# EAGLE design ADC (EAGLE 6.5.0)
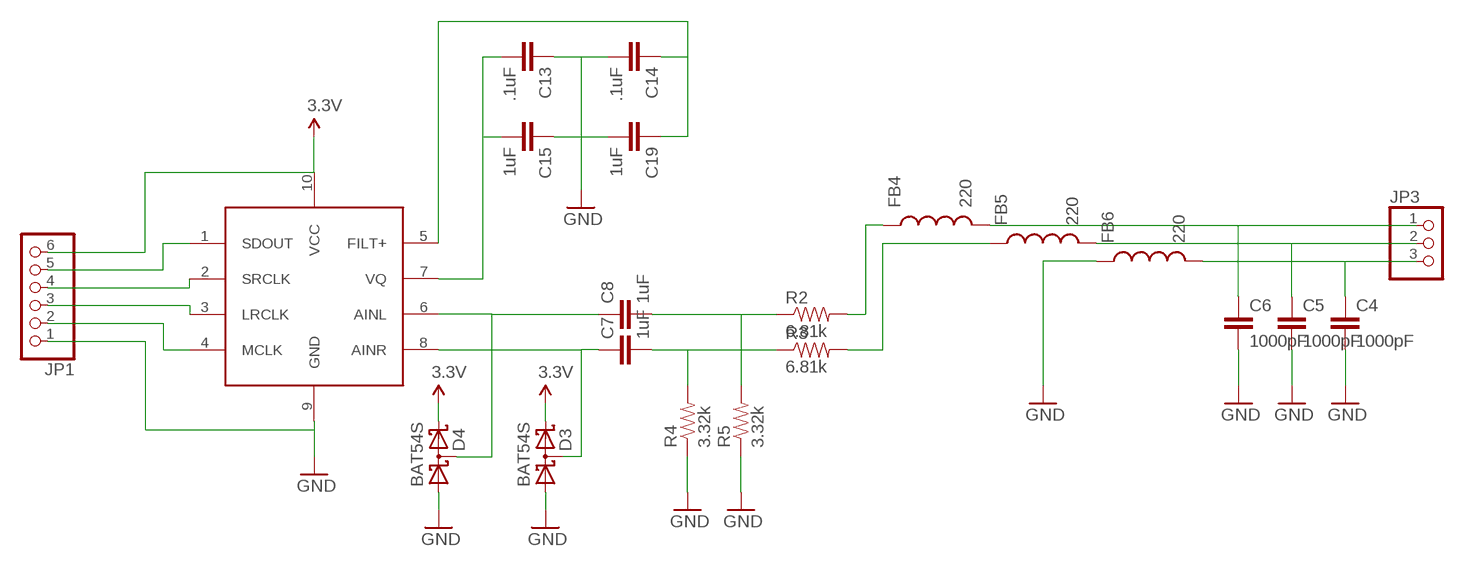
[diagram p0: schematic, sheet 1]

## Parts
C4  1000pF  CAP0402-CAP  [0402-CAP]
C5  1000pF  CAP0402-CAP  [0402-CAP]
C6  1000pF  CAP0402-CAP  [0402-CAP]
C7  1uF  CAP0402-CAP  [0402-CAP]
C8  1uF  CAP0402-CAP  [0402-CAP]
C13  .1uF  CAP0402-CAP  [0402-CAP]
C14  .1uF  CAP0402-CAP  [0402-CAP]
C15  1uF  CAP0402-CAP  [0402-CAP]
C19  1uF  CAP0402-CAP  [0402-CAP]
D3  BAT54S  [SOT23]
D4  BAT54S  [SOT23]
FB4  220  INDUCTOR0805  [0805]
FB5  220  INDUCTOR0805  [0805]
FB6  220  INDUCTOR0805  [0805]
JP1  PINHD-1X6  [1X06]
JP3  PINHD-1X3  [1X03]
R2  6.81k  RESISTOR0603-RES  [0603-RES]
R3  6.81k  RESISTOR0603-RES  [0603-RES]
R4  3.32k  RESISTOR0603-RES  [0603-RES]
R5  3.32k  RESISTOR0603-RES  [0603-RES]
U$3  CS5343  [TSSOP-10]

## Nets
AIN_SLEEV: C4.1 FB6.2 JP3.3
AINL: C6.1 FB4.2 JP3.1
AINL_C: C8.1 D4.3(C1A2) U$3.6(AINL)
AINL_FB: FB4.1 R2.2
AINL_R: C8.2 R2.1 R5.2
AINR: C5.1 FB5.2 JP3.2
AINR_C: C7.1 D3.3(C1A2) U$3.8(AINR)
AINR_FB: FB5.1 R3.2
AINR_R: C7.2 R3.1 R4.2
GND: C4.2 C5.2 C6.2 C13.1 C14.2 C15.1 C19.2 D3.1(A1) D4.1(A1) FB6.1 JP1.1 R4.1 R5.1 U$3.9(GND)
LRCLK: JP1.3 U$3.3(LRCLK)
MCLK: JP1.2 U$3.4(MCLK)
N$1: C13.2 C15.2 U$3.7(VQ)
N$6: C14.1 C19.1 U$3.5(FILT+)
SCLK: JP1.4 U$3.2(SRCLK)
SOUT: JP1.5 U$3.1(SDOUT)
VCC: D3.2(C2) D4.2(C2) JP1.6 U$3.10(VCC) ; supply symbol labelled 3.3V

## Library data of the parts
C4-C8 C13-C15 C19 = 1x05smd:CAP: Capacitor Standard 0603 ceramic capacitor, and 0.1" leaded capacitor.
D3 D4 = diode:BAT54S: Schottky Diodes Pin connection corrected 2011-05-04 Source: Fairchild .. BAT54.pdf
FB4-FB6 = SparkFun-Passives:INDUCTOR: Inductors Basic Inductor/Choke - 0603 and 1206. Footprints are not proven and vary greatly between part numbers.
JP1 = adafruit:PINHD-1X6: PIN HEADER
JP3 = adafruit:PINHD-1X3: PIN HEADER
R2-R5 = 1x05smd:RESISTOR: Resistor Basic schematic elements and footprints for 0603, 1206, and PTH 1/10th watt (small) resistors.
U$3 = Strutz Electronic Industries:CS5343

## Board
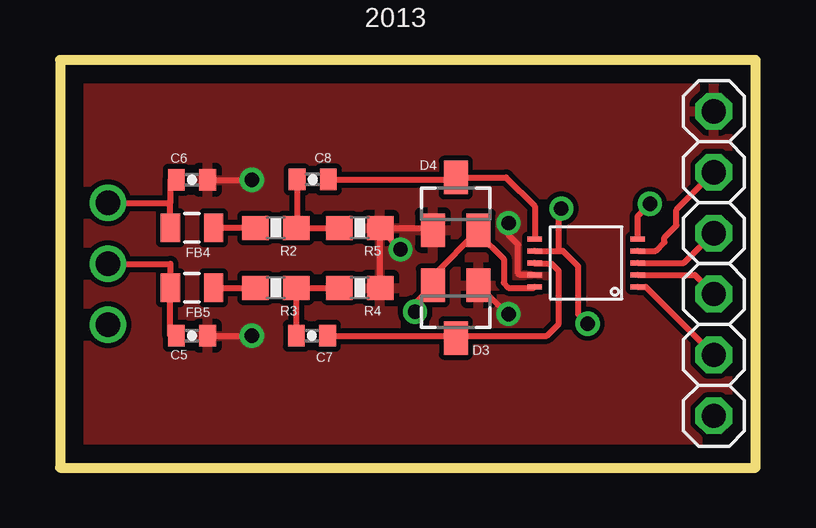
[diagram p1: board, top side]
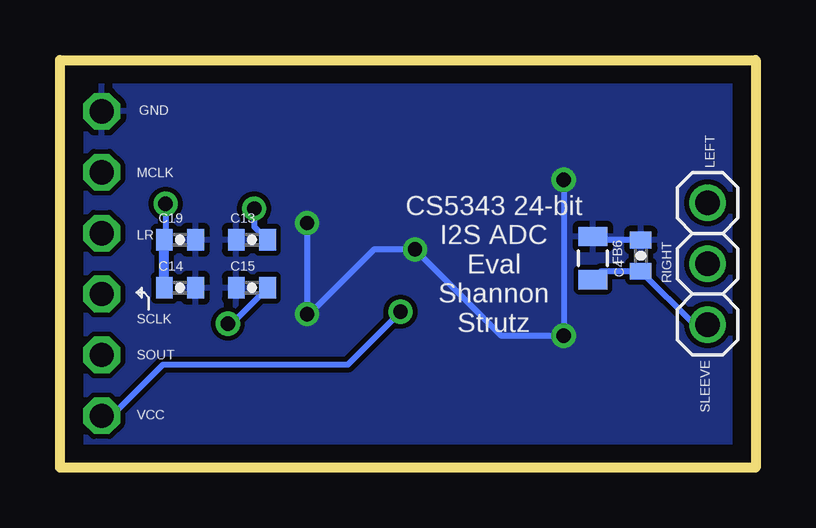
[diagram p2: board, bottom side, seen from below]

Size 29 x 17 mm. Coordinates in mm from the lower left corner, seen from the top.
Outline: 29,0 29,17 0,17 0,0 29,0
Copper layers (1*16): Top 0.035mm / dielectric 0.2mm / Bottom 0.035mm
Design rules "default *": minimum track width 10mil, minimum drill 24mil, track to track 8mil, track to pad 8mil, pad to pad 8mil, via to via 8mil, smd to smd 8mil, copper to edge 30mil, drill to drill 8mil, minimum pad ring 10mil, minimum via ring 8mil, stop-mask expansion 4mil, vias tented up to drill 0mil, thermal gap 10mil

### Footprints (pad centres in the part's own frame; a part is rotated, then mirrored left to right if it is on the bottom)
0402-CAP = smd 0.7 x 0.9: 1 -0.65,0; 2 0.65,0
SOT23 = smd 1 x 1.4: 1 -0.95,-1.1; 2 0.95,-1.1; 3 0,1.1
0805 = smd 0.8 x 1.2: 1 -0.9,0; 2 0.9,0
1X06 = drill 1.016 octagon: 1 -6.35,0; 2 -3.81,0; 3 -1.27,0; 4 1.27,0; 5 3.81,0; 6 6.35,0
1X03 = drill 1.016: 1 -2.54,0; 2 0,0; 3 2.54,0
0603-RES = smd 1.1 x 1: 1 -0.85,0; 2 0.85,0
TSSOP-10 = smd 0.6 x 0.2: 1 -2.15,1; 2 -2.15,0.5; 3 -2.15,0; 4 -2.15,-0.5; 5 -2.15,-1; 6 2.15,-1; 7 2.15,-0.5; 8 2.15,0; 9 2.15,0.5; 10 2.15,1

### Placement (x,y rotation side)
C4  4.78,8.84 90 bottom
C5  5.5,5.5 0 top
C6  5.5,12 0 top
C7  10.5,5.5 180 top
C8  10.54,12.02 180 top
C13  21,9.5 0 bottom
C14  24,7.5 0 bottom
C15  21,7.5 0 bottom
C19  24,9.5 0 bottom
D3  16.5,6.5 180 top
D4  16.5,11 0 top
FB4  5.5,10 180 top
FB5  5.5,7.5 180 top
FB6  6.78,8.74 270 bottom
JP1  27.26,8.51 270 top
JP3  2,8.5 270 bottom
R2  9,10 180 top
R3  9,7.5 180 top
R4  12.5,7.5 180 top
R5  12.5,10 180 top
U$3  21.94,8.53 180 top

### Tracks (layer width: path | path; a pad name or v marks a point on that pad's centre or on a via)
AIN_SLEEV
  Bottom 0.254: FB6.2 6.43,8.19 C4.1 2.56,5.96 JP3.3
AINL
  Top 0.254: JP3.1 4.6,11.04 | FB4.2 4.6,11.04 | C6.1 4.6,12 4.6,11.04
AINL_C
  Top 0.254: C8.1 16.42,12.02 D4.3 18.6,12.1 19.8,10.9 19.8,9.55 U$3.6
AINL_FB
  Top 0.254: R2.2 FB4.1
AINL_R
  Top 0.254: 11.69,10 R5.2 R2.1 9.89,10.04 C8.2
AINR
  Top 0.254: JP3.2 4.6,8.5 FB5.2 4.6,5.5 C5.1
AINR_C
  Top 0.254: C7.1 16.5,5.5 | 16.5,5.5 D3.3 | 16.5,5.5 20.3,5.5 20.8,6 20.8,8.2 20.5,8.5 19.82,8.5 U$3.8
AINR_FB
  Top 0.254: FB5.1 R3.2
AINR_R
  Top 0.254: R4.2 R3.1 C7.2
GND  (via drill 0.6)
  Top 0.254: 17.45,7.65 D3.1 18.25,6.8 v18.7,6.4 | 15.7,9.4 15.7,9.75 | 15.7,9.75 D4.1 15.45,10 | 13.4,10 R5.1 R4.1 | 13.4,10 15.45,10 | 15.7,9.75 15.7,9.9 15.6,10 15.45,10 | 13.4,10 13.4,9.9 v14.2,9.1 | U$3.9 19.17,8.03 19.1,8.1 19.1,9.3 18.7,9.7 v18.7,10.2 | C5.2 v8,5.5 | C6.2 v8,12
  Bottom 0.254: C4.2 6.63,9.49 FB6.1 | v18.7,10.2 v18.7,6.4 18.8,6.3 18.8,6.2 15.9,9.1 v14.2,9.1 10.6,5.5 v8,5.5 v8,12
  pour Bottom: 29,0 0,0 0,17 29,17
  pour Top: 0,17 29,17 29,0 0,0
LRCLK
  Top 0.254: U$3.3 26.02,8.53 JP1.3
MCLK
  Top 0.254: U$3.4 24.83,9.03 25.2,9.4 25.2,9.6 25.7,10.1 25.7,10.76 JP1.2
N$1  (via drill 0.6)
  Top 0.254: U$3.7 20.73,9.03 | 20.73,9.03 20.8,9.1 20.8,10.7 v20.9,10.8 | 20.73,9.03 20.97,9.03 21.6,8.4 21.6,6.4 v22,6
  Bottom 0.254: v20.9,10.8 20.9,10.05 C13.2 | v22,6 21.85,6 C15.2
N$6  (via drill 0.6)
  Top 0.254: U$3.5 24.09,10.49 v24.6,11
  Bottom 0.254: v24.6,11 24.6,9.55 C19.1
  Bottom 0.406: C14.1 C19.1
SCLK
  Top 0.254: U$3.2 26.47,8.03 JP1.4
SOUT
  Top 0.254: U$3.1 24.43,7.53 JP1.5
VCC  (via drill 0.6)
  Top 0.254: U$3.10 19.75,7.5 18.7,7.5 18.5,7.7 18.5,8.7 17.45,9.75 D4.2 15.55,8 D3.2 14.8,6.85 v14.8,6.5
  Bottom 0.254: JP1.6 26.84,2.16 24.7,4.3 17,4.3 v14.8,6.5

### Text on the board
_tsilk: Designed by Shannon Strutz / License CC BY-NC-SA 3.0 / 2013
_bsilk: GND | LEFT | MCLK | LR | RIGHT | CS5343 24-bit / I2S ADC / Eval / Shannon / Strutz | SCLK | SOUT | SLEEVE | VCC